# EAGLE design Suspension Alignment Bord rev1 (EAGLE 9.6.2)
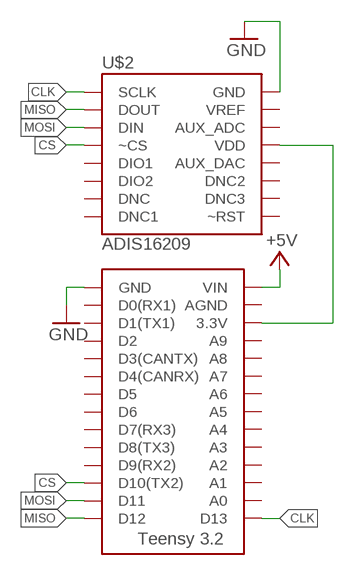
[diagram p0: schematic, sheet 1]

## Parts
U$1  TEENSY_3.2_SIMPLE  [TEENSY_3.2_SIMPLE]
U$2  ADIS16209  [CC-16-2]

## Nets
3.3V: U$1.3.3V U$2.P$13(VDD)
+5V: U$1.VIN
CLK: U$1.D13 U$2.P$1(SCLK)
CS: U$1.D10(TX2) U$2.P$4(~CS)
GND: U$1.GND U$2.P$16(GND)
MISO: U$1.D12 U$2.P$2(DOUT)
MOSI: U$1.D11 U$2.P$3(DIN)
Unconnected: U$1.A0 U$1.A1 U$1.A2 U$1.A3 U$1.A4 U$1.A5 U$1.A6 U$1.A7 U$1.A8 U$1.A9 U$1.AGND U$1.D0(RX1) U$1.D1(TX1) U$1.D2 U$1.D3(CANTX) U$1.D4(CANRX) U$1.D5 U$1.D6 U$1.D7(RX3) U$1.D8(TX3) U$1.D9(RX2) U$2.P$5(DIO1) U$2.P$6(DIO2) U$2.P$7(DNC) U$2.P$8(DNC1) U$2.P$9(~RST) U$2.P$10(DNC3) U$2.P$11(DNC2) U$2.P$12(AUX_DAC) U$2.P$14(AUX_ADC) U$2.P$15(VREF)

## Library data of the parts
U$1 = HyTechDevices:TEENSY_3.2_SIMPLE: Simple version of the Teensy 3.2 board that only uses the 2 main rows of pins, not the inner pins or the pins opposite the usb port.
U$2 = HyTechDevices:ADIS16209: Analog Devices ADIS16209 High Accuracy, Dual-Axis Digital Inclinometer and Accelerometer

## Board
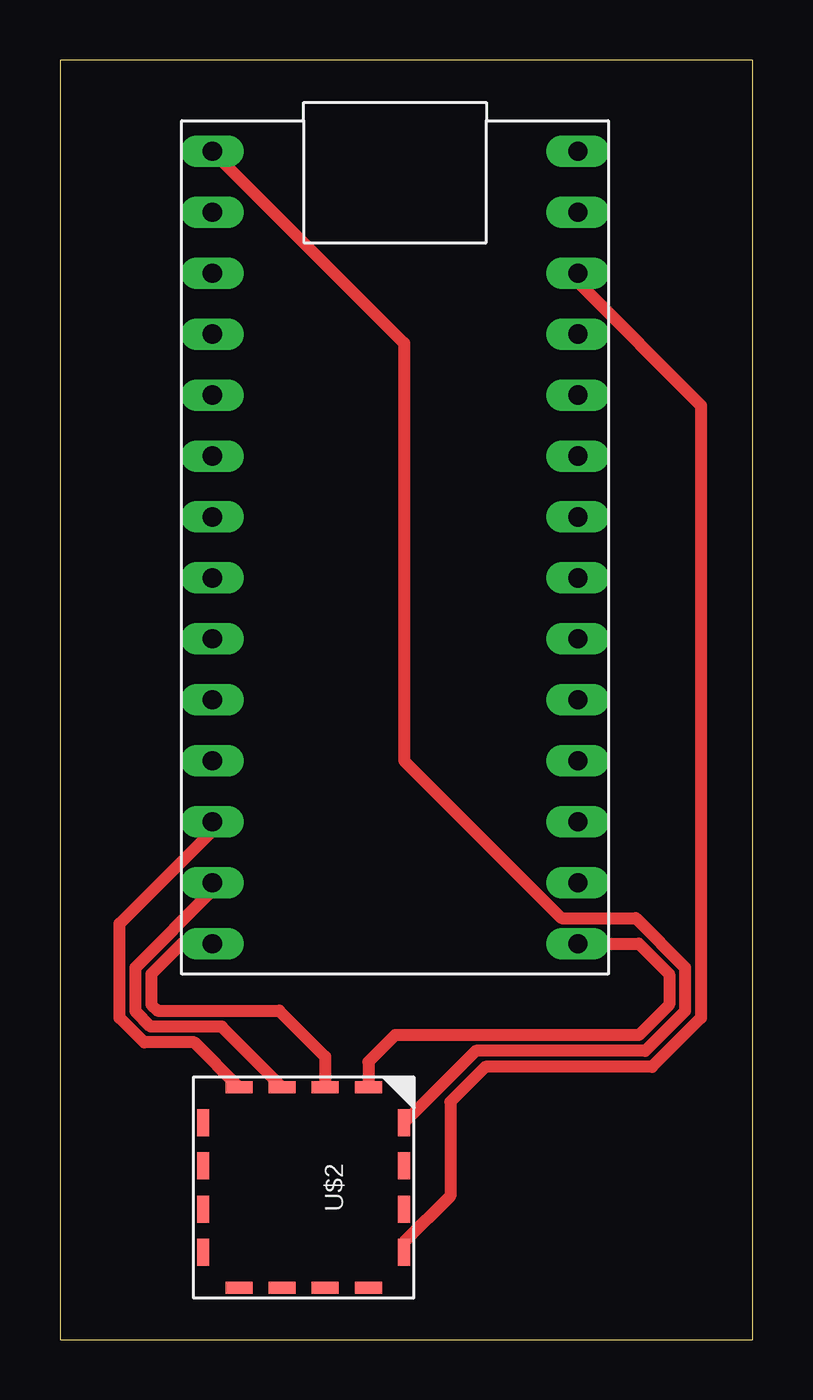
[diagram p1: board, top side]

Size 28.88 x 53.33 mm. Coordinates in mm from the lower left corner, seen from the top.
Outline: 0,0 28.88,0 28.88,53.33 0,53.33 0,0
Copper layers (1*16): Top 0.035mm / dielectric 1.5mm / Bottom 0.035mm
Design rules "default": minimum track width 6mil, minimum drill 0.35mm, track to track 6mil, track to pad 6mil, pad to pad 6mil, via to via 6mil, smd to smd 6mil, copper to edge 40mil, drill to drill 6mil, minimum pad ring 10mil, minimum via ring 8mil, stop-mask expansion 4mil, vias tented up to drill 0mil, thermal gap 10mil

### Footprints (pad centres in the part's own frame; a part is rotated, then mirrored left to right if it is on the bottom)
TEENSY_3.2_SIMPLE = drill 0.8 long: 3.3V 16.51,29.21; A0 16.51,3.81; A1 16.51,6.35; A2 16.51,8.89; A3 16.51,11.43; A4 16.51,13.97; A5 16.51,16.51; A6 16.51,19.05; A7 16.51,21.59; A8 16.51,24.13; A9 16.51,26.67; AGND 16.51,31.75; D0(RX1) 1.27,31.75; D1(TX1) 1.27,29.21; D2 1.27,26.67; D3(CANTX) 1.27,24.13; D4(CANRX) 1.27,21.59; D5 1.27,19.05; D6 1.27,16.51; D7(RX3) 1.27,13.97; D8(TX3) 1.27,11.43; D9(RX2) 1.27,8.89; D10(TX2) 1.27,6.35; D11 1.27,3.81; D12 1.27,1.27; D13 16.51,1.27; GND 1.27,34.29; VIN 16.51,34.29
CC-16-2 = smd 0.5 x 1.127: P$1 -4.186,2.696; P$2 -4.186,0.898; P$3 -4.186,-0.898; P$4 -4.186,-2.696; P$9 4.186,-2.696; P$10 4.186,-0.898; P$11 4.186,0.898; P$12 4.186,2.696 | smd 1.127 x 0.5: P$5 -2.696,-4.186; P$6 -0.898,-4.186; P$7 0.898,-4.186; P$8 2.696,-4.186; P$13 2.696,4.186; P$14 0.898,4.186; P$15 -0.898,4.186; P$16 -2.696,4.186

### Placement (x,y rotation side)
U$1  5.08,15.24 0 top
U$2  10.16,6.35 270 top

### Tracks (layer width: path | path; a pad name or v marks a point on that pad's centre or on a via)
3.3V
  Top 0.508: U$1.3.3V 21.59,44.06 26.72,38.93 26.72,13.42 24.68,11.38 17.73,11.38 16.27,9.92 16.27,5.99 14.35,4.06 U$2.P$13
CLK
  Top 0.508: U$1.D13 24.13,16.51 25.4,15.24 25.4,13.97 24.13,12.7 13.97,12.7 12.86,11.59 U$2.P$1
CS
  Top 0.508: U$1.D10(TX2) 6.35,21.2 2.49,17.34 2.49,13.42 3.52,12.39 5.61,12.39 U$2.P$4
GND
  Top 0.508: U$1.GND 14.35,41.53 14.35,24.14 20.92,17.57 24,17.57 26.06,15.51 26.06,13.7 24.4,12.04 17.34,12.04 U$2.P$16
MISO
  Top 0.508: U$1.D12 5.08,16.51 3.81,15.24 3.81,13.97 4.06,13.72 9.14,13.72 11.06,11.8 U$2.P$2
MOSI
  Top 0.508: U$2.P$3 6.74,13.06 3.79,13.06 3.15,13.7 3.15,15.51 6.35,18.71 U$1.D11